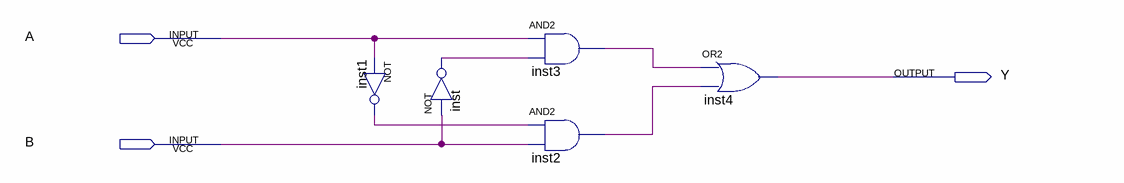
[diagram p0: schematic sheet]
// Quartus schematic LAB02_1.bdf as structural Verilog: 5 symbols, 3 pins
module LAB02_1 (
  input  A,
  input  B,
  output Y
);

  wire inst1_out, inst2_out, inst3_out, inst_out;

  not inst1 (inst1_out, A);
  not inst (inst_out, B);
  and inst3 (inst3_out, A, inst_out);
  and inst2 (inst2_out, inst1_out, B);
  or inst4 (Y, inst3_out, inst2_out);
endmodule
